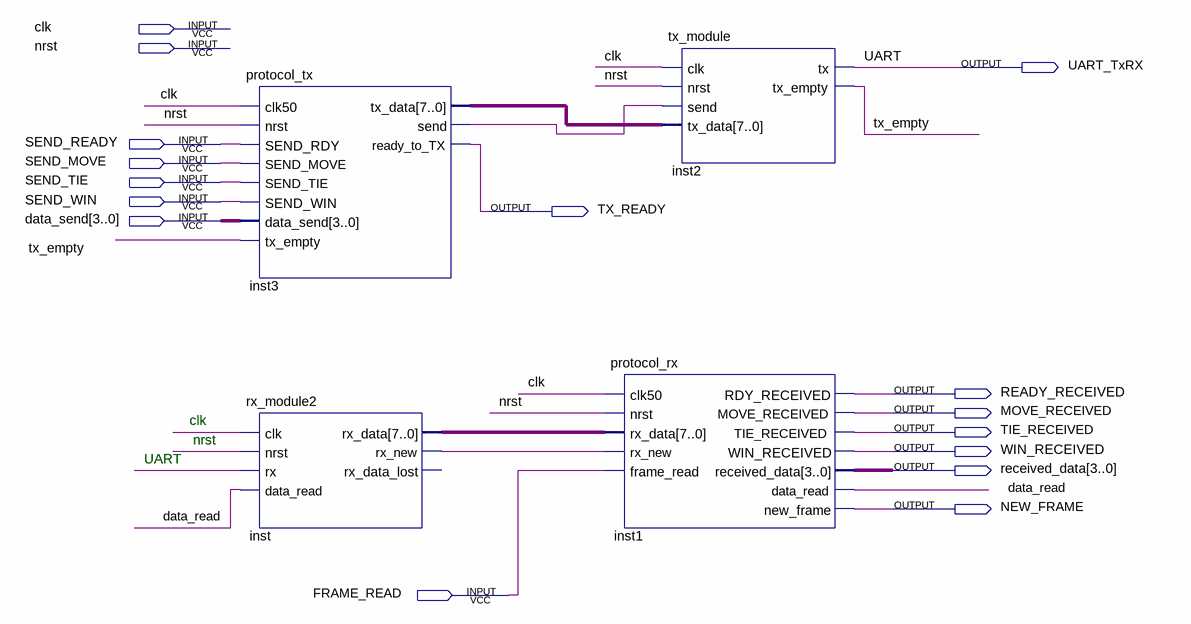
[diagram p0: schematic sheet]
// Quartus schematic comms_sim.bdf as structural Verilog: 4 symbols, 16 pins
module comms_sim (
  input  clk,
  input  nrst,
  input  SEND_READY,
  input  SEND_MOVE,
  input  SEND_TIE,
  input  SEND_WIN,
  input  [3:0] data_send,
  input  FRAME_READ,
  output UART_TxRX,
  output TX_READY,
  output READY_RECEIVED,
  output MOVE_RECEIVED,
  output TIE_RECEIVED,
  output WIN_RECEIVED,
  output [3:0] received_data,
  output NEW_FRAME
);

  wire data_read, inst3_send, inst_rx_new, tx_empty;
  wire [7:0] inst3_tx_data, inst_rx_data;

  protocol_tx inst3 (
    .clk50(clk), .nrst(nrst), .SEND_RDY(SEND_READY), .SEND_MOVE(SEND_MOVE), .SEND_TIE(SEND_TIE),
    .SEND_WIN(SEND_WIN), .data_send(data_send), .tx_empty(tx_empty), .tx_data(inst3_tx_data),
    .send(inst3_send), .ready_to_TX(TX_READY));
  rx_module2 inst (
    .clk(clk), .nrst(nrst), .rx(UART_TxRX), .data_read(data_read), .rx_data(inst_rx_data),
    .rx_new(inst_rx_new));  // open: rx_data_lost
  protocol_rx inst1 (
    .clk50(clk), .nrst(nrst), .rx_data(inst_rx_data), .rx_new(inst_rx_new), .frame_read(FRAME_READ),
    .RDY_RECEIVED(READY_RECEIVED), .MOVE_RECEIVED(MOVE_RECEIVED), .TIE_RECEIVED(TIE_RECEIVED),
    .WIN_RECEIVED(WIN_RECEIVED), .received_data(received_data), .data_read(data_read), .new_frame(NEW_FRAME));
  tx_module inst2 (
    .clk(clk), .nrst(nrst), .send(inst3_send), .tx_data(inst3_tx_data), .tx(UART_TxRX), .tx_empty(tx_empty));

  // Other names for the same wires on the sheet: UART = UART_TxRX

  // Notes on the sheet:
  //   clk
  //   nrst
  //   UART
endmodule
